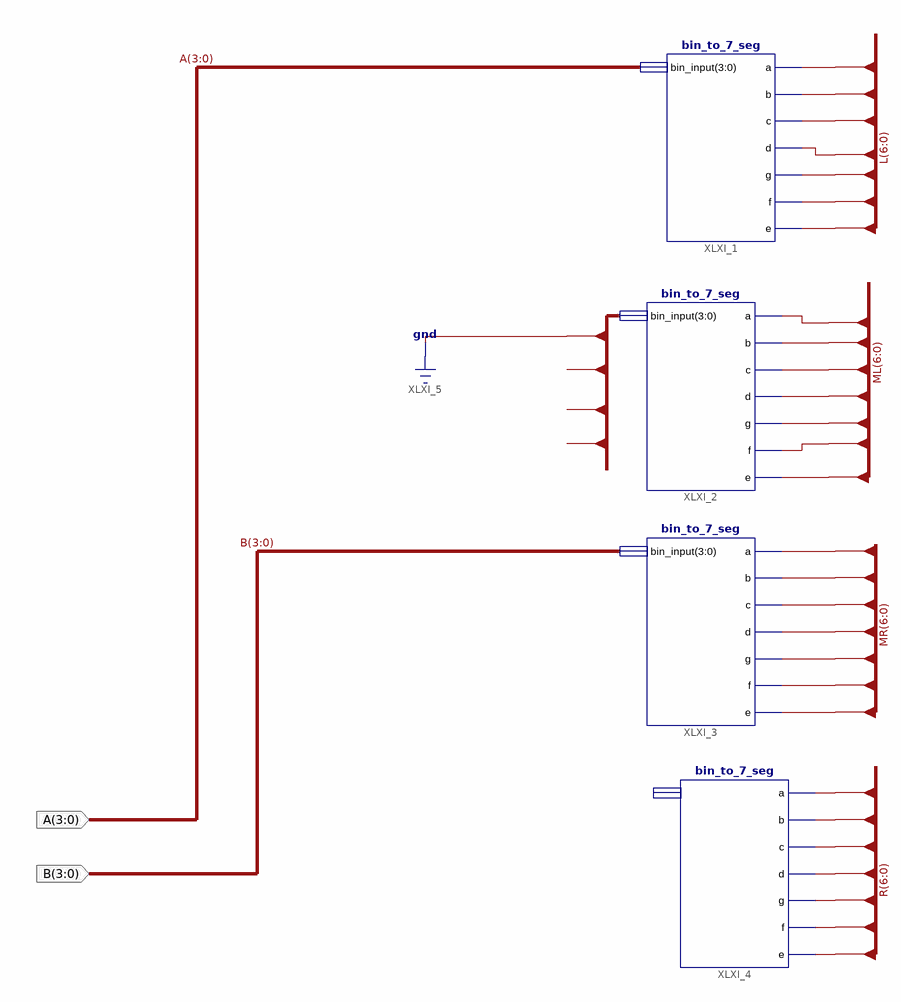
[diagram p0: schematic sheet 1]
// Xilinx ISE schematic better_seven_seg_alu.sch (spartan3e) as structural Verilog: 4 symbols, 2 ports
module better_seven_seg_alu (
  input  [3:0] A,
  input  [3:0] B
);

  wire XLXN_7, XLXN_8, XLXN_9, XLXN_10, XLXN_11, XLXN_12, XLXN_13, XLXN_14, XLXN_15, XLXN_16, XLXN_17,
       XLXN_18, XLXN_19, XLXN_20, XLXN_21, XLXN_22, XLXN_23, XLXN_24, XLXN_25, XLXN_26, XLXN_27, XLXN_28,
       XLXN_29, XLXN_30, XLXN_31, XLXN_32, XLXN_35, XLXN_36;
  wire [3:0] XLXN_2;

  bin_to_7_seg XLXI_1 (
    .bin_input(A), .a(XLXN_28), .b(XLXN_29), .c(XLXN_30), .d(XLXN_31), .g(XLXN_32), .f(XLXN_35), .e(XLXN_36));
  bin_to_7_seg XLXI_2 (
    .bin_input(XLXN_2), .a(XLXN_21), .b(XLXN_22), .c(XLXN_23), .d(XLXN_24), .g(XLXN_25), .f(XLXN_26),
    .e(XLXN_27));
  bin_to_7_seg XLXI_3 (
    .bin_input(B), .a(XLXN_14), .b(XLXN_15), .c(XLXN_16), .d(XLXN_17), .g(XLXN_18), .f(XLXN_19), .e(XLXN_20));
  bin_to_7_seg XLXI_4 (
    .a(XLXN_7), .b(XLXN_8), .c(XLXN_9), .d(XLXN_10), .g(XLXN_11), .f(XLXN_12), .e(XLXN_13));  // open: bin_input
endmodule
